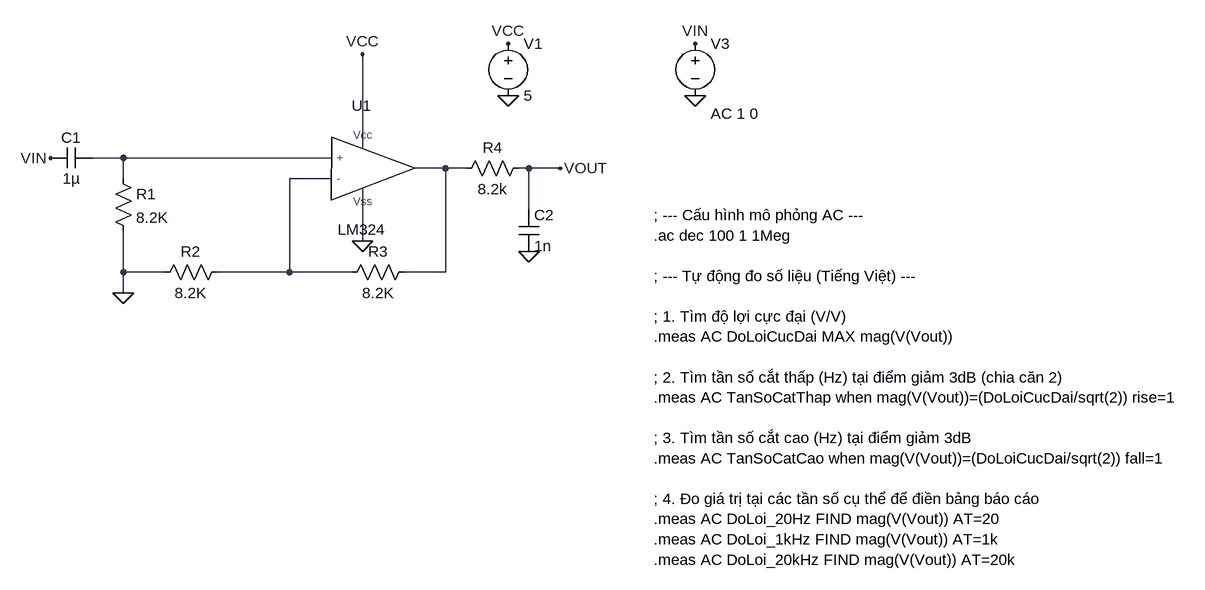
[diagram p0: schematic BAI 4 THUC HANH 2.asc]
BAI 4 THUC HANH 2.asc, the LTspice schematic file:
Version 4.1
SHEET 1 1620 756
WIRE 288 160 288 16
WIRE -80 176 -128 176
WIRE 240 176 -80 176
WIRE 416 192 368 192
WIRE 448 192 416 192
WIRE 544 192 528 192
WIRE 592 192 544 192
WIRE -80 208 -80 176
WIRE 240 208 176 208
WIRE 544 256 544 192
WIRE 288 304 288 224
WIRE -80 352 -80 288
WIRE -16 352 -80 352
WIRE 176 352 176 208
WIRE 176 352 64 352
WIRE 272 352 176 352
WIRE 416 352 416 192
WIRE 416 352 352 352
WIRE -80 384 -80 352
FLAG 592 192 VOUT
FLAG 544 320 0
FLAG -80 384 0
FLAG -192 176 VIN
FLAG 288 16 VCC
FLAG 512 0 VCC
FLAG 512 80 0
FLAG 800 80 0
FLAG 800 0 VIN
FLAG 288 304 0
SYMBOL LM324 288 192 R0
SYMATTR InstName U1
SYMBOL res 432 208 R270
WINDOW 0 32 56 VTop 2
WINDOW 3 0 56 VBottom 2
SYMATTR InstName R4
SYMATTR Value 8.2k
SYMBOL cap 528 256 R0
SYMATTR InstName C2
SYMATTR Value 1n
SYMBOL res 368 336 R90
WINDOW 0 0 56 VBottom 2
WINDOW 3 32 56 VTop 2
SYMATTR InstName R3
SYMATTR Value 8.2K
SYMBOL res 80 336 R90
WINDOW 0 0 56 VBottom 2
WINDOW 3 32 56 VTop 2
SYMATTR InstName R2
SYMATTR Value 8.2K
SYMBOL res -96 192 R0
SYMATTR InstName R1
SYMATTR Value 8.2K
SYMBOL cap -128 160 R90
WINDOW 0 0 32 VBottom 2
WINDOW 3 32 32 VTop 2
SYMATTR InstName C1
SYMATTR Value 1µ
SYMBOL voltage 512 -16 R0
SYMATTR InstName V1
SYMATTR Value 5
SYMBOL voltage 800 -16 R0
WINDOW 123 24 124 Left 2
WINDOW 39 0 0 Left 0
SYMATTR InstName V3
SYMATTR Value ""
SYMATTR Value2 AC 1 0
TEXT 736 264 Left 2 !; --- Cấu hình mô phỏng AC ---\n.ac dec 100 1 1Meg\n \n; --- Tự động đo số liệu (Tiếng Việt) ---\n \n; 1. Tìm độ lợi cực đại (V/V)\n.meas AC DoLoiCucDai MAX mag(V(Vout))\n \n; 2. Tìm tần số cắt thấp (Hz) tại điểm giảm 3dB (chia căn 2)\n.meas AC TanSoCatThap when mag(V(Vout))=(DoLoiCucDai/sqrt(2)) rise=1\n \n; 3. Tìm tần số cắt cao (Hz) tại điểm giảm 3dB\n.meas AC TanSoCatCao when mag(V(Vout))=(DoLoiCucDai/sqrt(2)) fall=1\n \n; 4. Đo giá trị tại các tần số cụ thể để điền bảng báo cáo\n.meas AC DoLoi_20Hz FIND mag(V(Vout)) AT=20\n.meas AC DoLoi_1kHz FIND mag(V(Vout)) AT=1k\n.meas AC DoLoi_20kHz FIND mag(V(Vout)) AT=20k

The netlist it stands for:
* BAI 4 THUC HANH 2.asc
X§U1 N001 N003 VCC 0 N002 LM324  ; pins + - Vcc Vss ?
R4 N002 VOUT 8.2k
C2 VOUT 0 1n
R3 N002 N003 8.2K
R2 N003 0 8.2K
R1 N001 0 8.2K
C1 N001 VIN 1µ
V1 VCC 0 5
V3 VIN 0 AC 1 0
; --- Cấu hình mô phỏng AC ---
.ac dec 100 1 1Meg
; --- Tự động đo số liệu (Tiếng Việt) ---
; 1. Tìm độ lợi cực đại (V/V)
.meas AC DoLoiCucDai MAX mag(V(Vout))
; 2. Tìm tần số cắt thấp (Hz) tại điểm giảm 3dB (chia căn 2)
.meas AC TanSoCatThap when mag(V(Vout))=(DoLoiCucDai/sqrt(2)) rise=1
; 3. Tìm tần số cắt cao (Hz) tại điểm giảm 3dB
.meas AC TanSoCatCao when mag(V(Vout))=(DoLoiCucDai/sqrt(2)) fall=1
; 4. Đo giá trị tại các tần số cụ thể để điền bảng báo cáo
.meas AC DoLoi_20Hz FIND mag(V(Vout)) AT=20
.meas AC DoLoi_1kHz FIND mag(V(Vout)) AT=1k
.meas AC DoLoi_20kHz FIND mag(V(Vout)) AT=20k
.lib E:\ThiThucHanhCoHa\CoHa\LM324.cir
.backanno
.end